# EAGLE design nano_adapter (EAGLE 6.4)
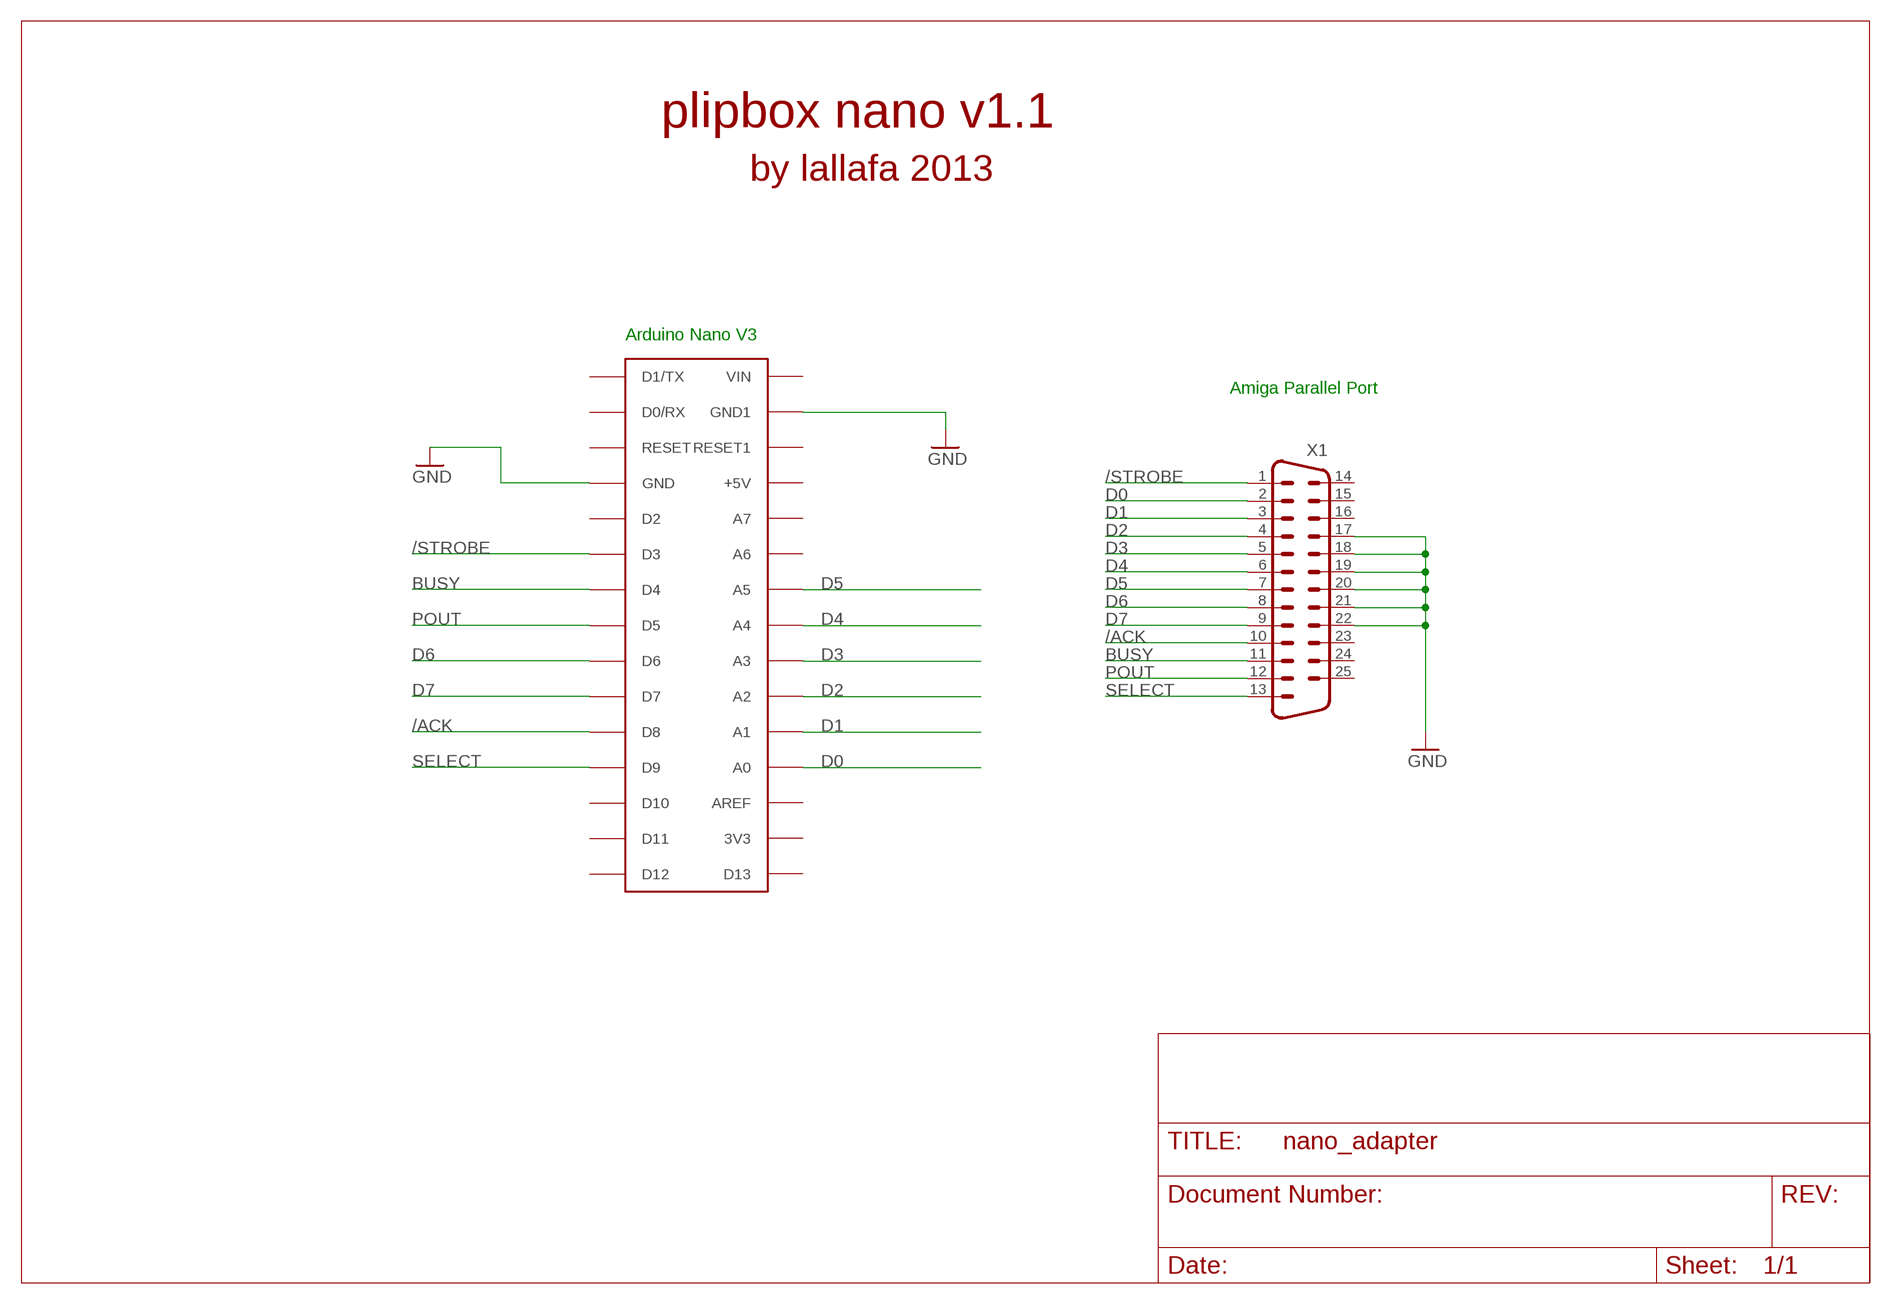
[diagram p0: schematic, sheet 1]

## Parts
U$1  ARDUINONANO  [PDIP-32]
X1  M25HP  [M25HP]

## Nets
/ACK: U$1.D8 X1.10
/STROBE: U$1.D3 X1.1
BUSY: U$1.D4 X1.11
D0: U$1.A7(A0) X1.2
D1: U$1.A6(A1) X1.3
D2: U$1.A5(A2) X1.4
D3: U$1.A4(A3) X1.5
D4: U$1.A3(A4) X1.6
D5: U$1.A2(A5) X1.7
D6: U$1.D6 X1.8
D7: U$1.D7 X1.9
GND: U$1.GND U$1.GND1 X1.17 X1.18 X1.19 X1.20 X1.21 X1.22
POUT: U$1.D5 X1.12
SELECT: U$1.D9 X1.13
Unconnected: U$1.3V3 U$1.+5V U$1.A0(A7) U$1.A1(A6) U$1.AREF U$1.D0/RX U$1.D1/TX U$1.D2 U$1.D10 U$1.D11 U$1.D12 U$1.D13 U$1.RESET U$1.RESET1 U$1.VIN X1.14 X1.15 X1.16 X1.23 X1.24 X1.25 X1.G1 X1.G2

## Notes on the sheet
- plipbox nano v1.1
- by lallafa 2013
- Arduino Nano V3
- Amiga Parallel Port

## Library data of the parts
U$1 = jet-lib:ARDUINONANO
X1 = con-subd:M25HP: SUB-D; OC_FARNELL: unknown; OC_NEWARK: unknown

## Board
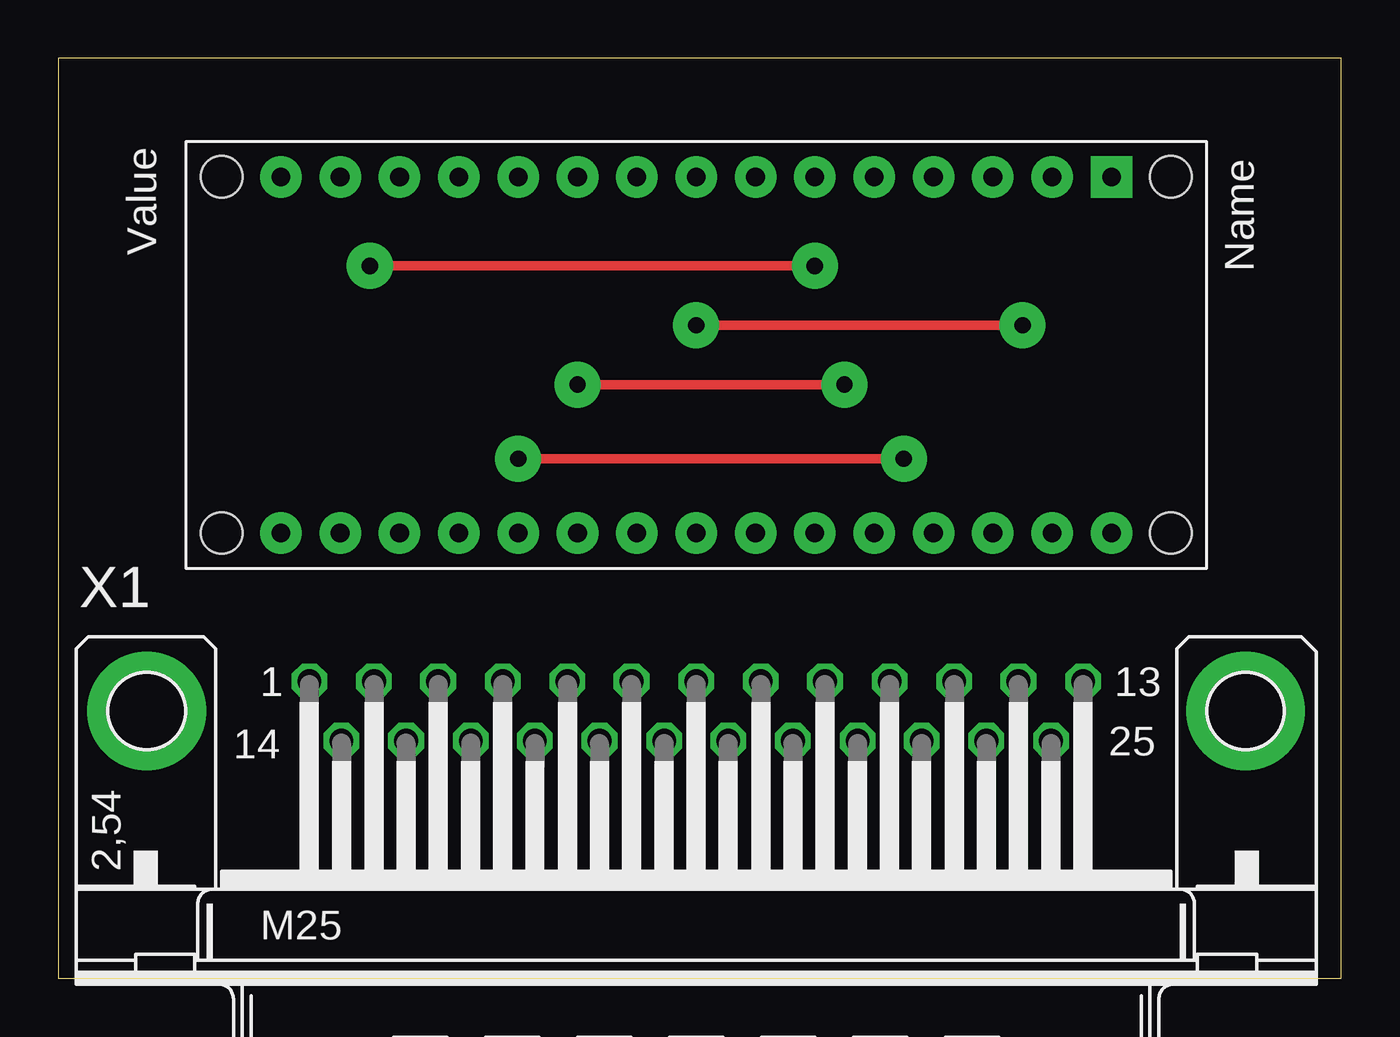
[diagram p1: board, top side]
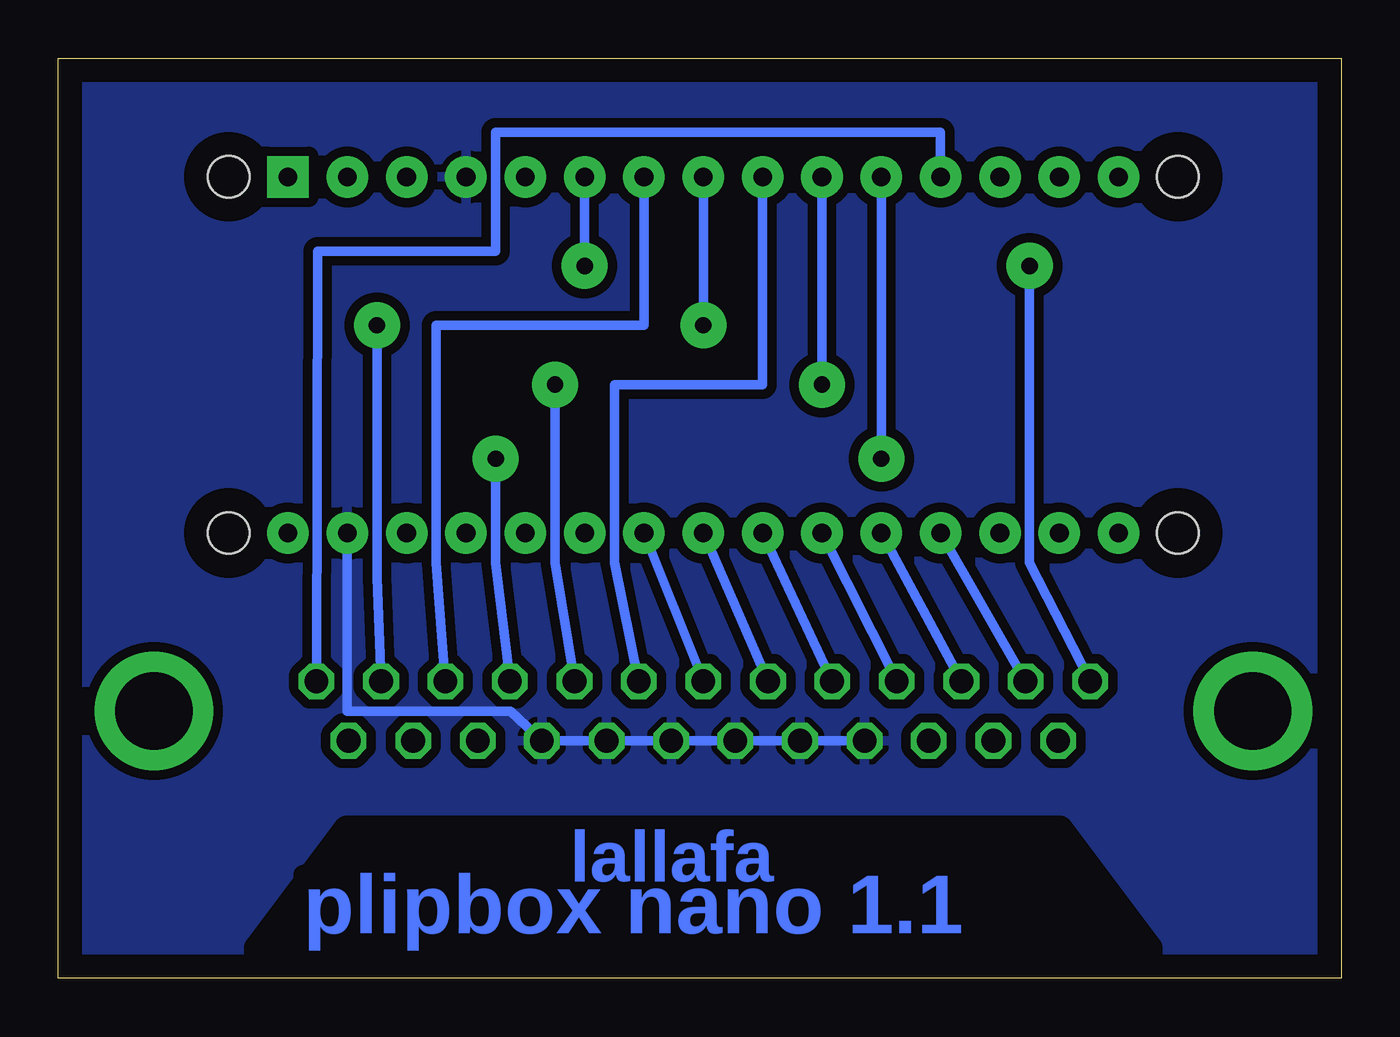
[diagram p2: board, bottom side, seen from below]

Size 54.91 x 39.36 mm. Coordinates in mm from the lower left corner, seen from the top.
Outline: 0,0 54.91,0 54.91,39.36 0,39.36 0,0
Copper layers (1*16): Top 0.035mm / dielectric 1.5mm / Bottom 0.035mm
Design rules "default *": minimum track width 10mil, minimum drill 24mil, track to track 8mil, track to pad 8mil, pad to pad 8mil, via to via 8mil, smd to smd 8mil, copper to edge 40mil, drill to drill 8mil, minimum pad ring 10mil, minimum via ring 25mil, stop-mask expansion 4mil, vias tented up to drill 0mil, thermal gap 10mil
bRestrict: area 8.3,1.3 to 46.4,6.3

### Footprints (pad centres in the part's own frame; a part is rotated, then mirrored left to right if it is on the bottom)
PDIP-32 = drill 0.8 pad 1.778: 3V3 15.24,-35.56; +5V 15.24,-10.16; A0 15.24,-12.7; A1 15.24,-15.24; A2 15.24,-17.78; A3 15.24,-20.32; A4 15.24,-22.86; A5 15.24,-25.4; A6 15.24,-27.94; A7 15.24,-30.48; AREF 15.24,-33.02; D0/RX 0,-5.08; D2 0,-12.7; D3 0,-15.24; D4 0,-17.78; D5 0,-20.32; D6 0,-22.86; D7 0,-25.4; D8 0,-27.94; D9 0,-30.48; D10 0,-33.02; D11 0,-35.56; D12 0,-38.1; D13 15.24,-38.1; GND 0,-10.16; GND1 15.24,-5.08; RESET 0,-7.62; RESET1 15.24,-7.62; VIN 15.24,-2.54 | drill 0.8 pad 1.778 square: D1/TX 0,-2.54 | hole 1.778: 0,0; 0,-40.64; 15.24,-40.64; 15.24,0
M25HP = drill 1.016 octagon: 1 -16.561,1.27; 2 -13.792,1.27; 3 -11.049,1.27; 4 -8.28,1.27; 5 -5.512,1.27; 6 -2.769,1.27; 7 0,1.27; 8 2.769,1.27; 9 5.512,1.27; 10 8.28,1.27; 11 11.049,1.27; 12 13.792,1.27; 13 16.561,1.27; 14 -15.189,-1.27; 15 -12.421,-1.27; 16 -9.652,-1.27; 17 -6.909,-1.27; 18 -4.14,-1.27; 19 -1.372,-1.27; 20 1.372,-1.27; 21 4.14,-1.27; 22 6.909,-1.27; 23 9.652,-1.27; 24 12.421,-1.27; 25 15.189,-1.27 | drill 3.302 pad 5.08: G1 -23.52,0; G2 23.52,0

### Placement (x,y rotation side)
U$1  47.62,34.29 270 top
X1  27.3,11.43 0 top

### Tracks (layer width: path | path; a pad name or v marks a point on that pad's centre or on a via)
/ACK  (via drill 0.7)
  Top 0.406: v19.68,22.23 v36.2,22.23
  Bottom 0.406: X1.10 36.2,17.78 36.2,20.95 v36.2,22.23 | U$1.D8 19.68,33.66 19.68,22.86 v19.68,22.23
/STROBE  (via drill 0.7)
  Top 0.406: v13.34,30.48 v32.38,30.48
  Bottom 0.406: X1.1 13.34,17.78 v13.34,30.48 | v32.38,30.48 U$1.D3
BUSY
  Bottom 0.406: X1.11 38.73,17.78 38.73,20.95 38.73,27.94 29.84,27.94 U$1.D4
D0
  Bottom 0.406: X1.2 U$1.A7
D1
  Bottom 0.406: X1.3 U$1.A6
D2
  Bottom 0.406: X1.4 U$1.A5
D3
  Bottom 0.406: X1.5 U$1.A4
D4
  Bottom 0.406: X1.6 U$1.A3
D5
  Bottom 0.406: X1.7 U$1.A2
D6
  Bottom 0.406: X1.8 31.11,17.78 31.11,20.95 31.11,25.4 24.77,25.4 24.77,33.66 U$1.D6
D7  (via drill 0.7)
  Top 0.406: v22.23,25.4 v33.66,25.4
  Bottom 0.406: X1.9 33.66,17.78 33.66,20.95 v33.66,25.4 | U$1.D7 22.23,33.02 v22.23,25.4
GND
  Bottom 0.406: X1.17 X1.22 35.56,11.43 42.55,11.43 U$1.GND1
  pour Bottom (isolate 0.406): 0,39.37 55.24,39.37 55.24,0 0,0 0,1.91
POUT  (via drill 0.7)
  Top 0.406: v27.3,27.94 v41.27,27.94
  Bottom 0.406: X1.12 41.27,17.14 41.27,20.95 v41.27,27.94 | U$1.D5 v27.3,27.94
SELECT
  Bottom 0.406: U$1.D9 17.14,36.2 36.2,36.2 36.2,31.11 43.81,31.11 X1.13

### Text on the board
Bottom: lallafa | plipbox nano 1.1